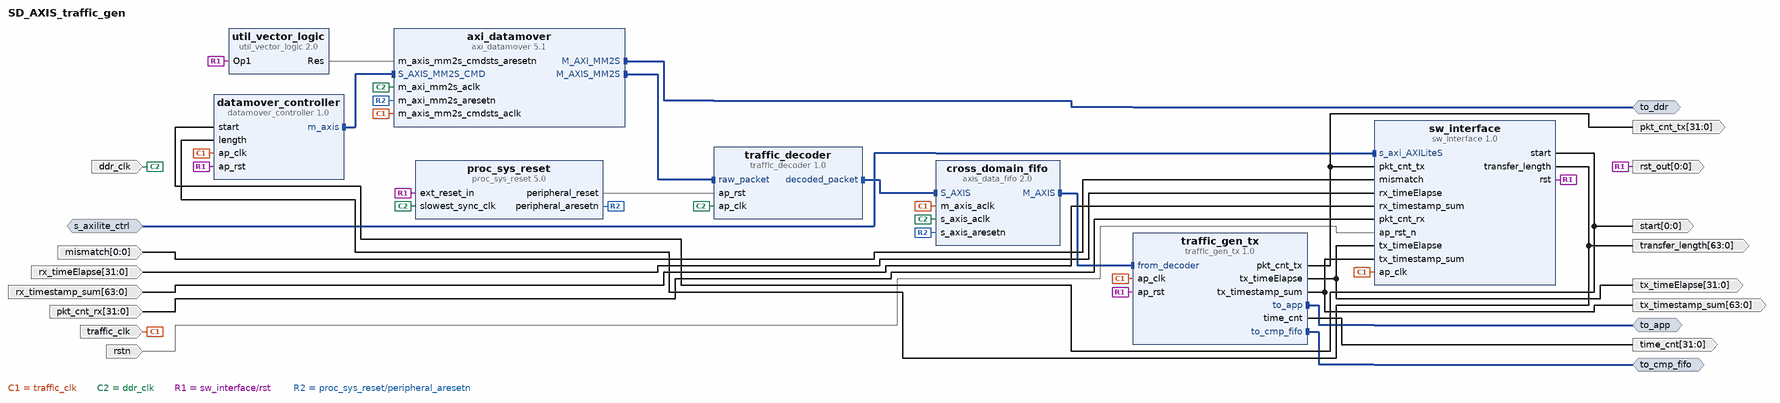
[diagram p0: block diagram of the top level]
# Vivado block design SD_AXIS_traffic_gen, xczu19eg-ffvc1760-2-i, Vivado 2019.1
create_bd_design SD_AXIS_traffic_gen

create_bd_intf_port -mode Slave -vlnv xilinx.com:interface:aximm_rtl:1.0 s_axilite_ctrl
set_property -dict [list \
  CONFIG.ADDR_WIDTH 12 \
  CONFIG.ARUSER_WIDTH 0 \
  CONFIG.AWUSER_WIDTH 0 \
  CONFIG.BUSER_WIDTH 0 \
  CONFIG.DATA_WIDTH 32 \
  CONFIG.HAS_BRESP 1 \
  CONFIG.HAS_BURST 0 \
  CONFIG.HAS_CACHE 0 \
  CONFIG.HAS_LOCK 0 \
  CONFIG.HAS_PROT 0 \
  CONFIG.HAS_QOS 0 \
  CONFIG.HAS_REGION 0 \
  CONFIG.HAS_RRESP 1 \
  CONFIG.HAS_WSTRB 1 \
  CONFIG.ID_WIDTH 0 \
  CONFIG.MAX_BURST_LENGTH 1 \
  CONFIG.NUM_READ_OUTSTANDING 1 \
  CONFIG.NUM_READ_THREADS 1 \
  CONFIG.NUM_WRITE_OUTSTANDING 1 \
  CONFIG.NUM_WRITE_THREADS 1 \
  CONFIG.PROTOCOL AXI4LITE \
  CONFIG.READ_WRITE_MODE READ_WRITE \
  CONFIG.RUSER_BITS_PER_BYTE 0 \
  CONFIG.RUSER_WIDTH 0 \
  CONFIG.SUPPORTS_NARROW_BURST 0 \
  CONFIG.WUSER_BITS_PER_BYTE 0 \
  CONFIG.WUSER_WIDTH 0 \
] [get_bd_intf_ports s_axilite_ctrl]
create_bd_intf_port -mode Master -vlnv xilinx.com:interface:axis_rtl:1.0 to_app
create_bd_intf_port -mode Master -vlnv xilinx.com:interface:aximm_rtl:1.0 to_ddr
set_property -dict [list \
  CONFIG.ADDR_WIDTH 64 \
  CONFIG.DATA_WIDTH 512 \
  CONFIG.HAS_BRESP 0 \
  CONFIG.HAS_BURST 0 \
  CONFIG.HAS_CACHE 0 \
  CONFIG.HAS_LOCK 0 \
  CONFIG.HAS_PROT 0 \
  CONFIG.HAS_QOS 0 \
  CONFIG.HAS_REGION 0 \
  CONFIG.HAS_WSTRB 0 \
  CONFIG.NUM_READ_OUTSTANDING 2 \
  CONFIG.NUM_WRITE_OUTSTANDING 2 \
  CONFIG.PROTOCOL AXI4 \
  CONFIG.READ_WRITE_MODE READ_ONLY \
] [get_bd_intf_ports to_ddr]
create_bd_intf_port -mode Master -vlnv xilinx.com:interface:axis_rtl:1.0 to_cmp_fifo
create_bd_port -dir I -from 0 -to 0 mismatch
create_bd_port -dir I -from 31 -to 0 rx_timeElapse
create_bd_port -dir I -from 63 -to 0 rx_timestamp_sum
create_bd_port -dir I -from 31 -to 0 pkt_cnt_rx
create_bd_port -dir I -type clk traffic_clk
create_bd_port -dir I -type rst rstn
create_bd_port -dir O -from 0 -to 0 start
create_bd_port -dir O -from 63 -to 0 transfer_length
create_bd_port -dir I -type clk ddr_clk
create_bd_port -dir O -from 31 -to 0 tx_timeElapse
create_bd_port -dir O -from 63 -to 0 tx_timestamp_sum
create_bd_port -dir O -from 31 -to 0 pkt_cnt_tx
create_bd_port -dir O -from 31 -to 0 time_cnt
create_bd_port -dir O -from 0 -to 0 -type rst rst_out

create_bd_cell -type ip -vlnv clarkshen.com:user:sw_interface:1.0 sw_interface
create_bd_cell -type ip -vlnv clarkshen.com:user:datamover_controller:1.0 datamover_controller
create_bd_cell -type ip -vlnv xilinx.com:ip:axi_datamover:5.1 axi_datamover
set_property -dict [list \
  CONFIG.c_addr_width 64 \
  CONFIG.c_dummy 1 \
  CONFIG.c_enable_s2mm 0 \
  CONFIG.c_m_axi_mm2s_data_width 512 \
  CONFIG.c_m_axi_mm2s_id_width 0 \
  CONFIG.c_m_axis_mm2s_tdata_width 512 \
  CONFIG.c_mm2s_btt_used 23 \
  CONFIG.c_mm2s_burst_size 64 \
] [get_bd_cells axi_datamover]
create_bd_cell -type ip -vlnv clarkshen.com:user:traffic_decoder:1.0 traffic_decoder
create_bd_cell -type ip -vlnv xilinx.com:ip:axis_data_fifo:2.0 cross_domain_fifo
set_property -dict {CONFIG.FIFO_DEPTH 64 CONFIG.IS_ACLK_ASYNC 1 CONFIG.SYNCHRONIZATION_STAGES 8} [get_bd_cells cross_domain_fifo]
create_bd_cell -type ip -vlnv clarkshen.com:user:traffic_gen_tx:1.0 traffic_gen_tx
create_bd_cell -type ip -vlnv xilinx.com:ip:util_vector_logic:2.0 util_vector_logic
set_property -dict {CONFIG.C_OPERATION not CONFIG.C_SIZE 1} [get_bd_cells util_vector_logic]
create_bd_cell -type ip -vlnv xilinx.com:ip:proc_sys_reset:5.0 proc_sys_reset
set_property -dict {CONFIG.C_EXT_RST_WIDTH 1} [get_bd_cells proc_sys_reset]

# ---- connections ----

connect_bd_intf_net -intf_net s_axi_AXILiteS_0_1 [get_bd_intf_ports s_axilite_ctrl] [get_bd_intf_pins sw_interface/s_axi_AXILiteS]
connect_bd_intf_net [get_bd_intf_ports to_app] [get_bd_intf_pins traffic_gen_tx/to_app]
connect_bd_intf_net [get_bd_intf_ports to_ddr] [get_bd_intf_pins axi_datamover/M_AXI_MM2S]
connect_bd_intf_net [get_bd_intf_ports to_cmp_fifo] [get_bd_intf_pins traffic_gen_tx/to_cmp_fifo]
connect_bd_intf_net [get_bd_intf_pins datamover_controller/m_axis] [get_bd_intf_pins axi_datamover/S_AXIS_MM2S_CMD]
connect_bd_intf_net [get_bd_intf_pins axi_datamover/M_AXIS_MM2S] [get_bd_intf_pins traffic_decoder/raw_packet]
connect_bd_intf_net [get_bd_intf_pins traffic_decoder/decoded_packet] [get_bd_intf_pins cross_domain_fifo/S_AXIS]
connect_bd_intf_net [get_bd_intf_pins cross_domain_fifo/M_AXIS] [get_bd_intf_pins traffic_gen_tx/from_decoder]
connect_bd_net -net mismatch_0_1 [get_bd_ports mismatch] [get_bd_pins sw_interface/mismatch]
connect_bd_net -net rx_timeElapse_0_1 [get_bd_ports rx_timeElapse] [get_bd_pins sw_interface/rx_timeElapse]
connect_bd_net -net rx_timestamp_sum_0_1 [get_bd_ports rx_timestamp_sum] [get_bd_pins sw_interface/rx_timestamp_sum]
connect_bd_net -net pkt_cnt_rx_0_1 [get_bd_ports pkt_cnt_rx] [get_bd_pins sw_interface/pkt_cnt_rx]
connect_bd_net -net ap_clk_0_1 [get_bd_ports traffic_clk] \
  [get_bd_pins sw_interface/ap_clk] [get_bd_pins datamover_controller/ap_clk] \
  [get_bd_pins axi_datamover/m_axis_mm2s_cmdsts_aclk] [get_bd_pins cross_domain_fifo/m_axis_aclk] \
  [get_bd_pins traffic_gen_tx/ap_clk]
connect_bd_net -net ap_rst_n_0_1 [get_bd_ports rstn] [get_bd_pins sw_interface/ap_rst_n]
connect_bd_net [get_bd_pins sw_interface/start] [get_bd_ports start] [get_bd_pins datamover_controller/start]
connect_bd_net [get_bd_pins sw_interface/transfer_length] [get_bd_ports transfer_length] [get_bd_pins datamover_controller/length]
connect_bd_net -net ap_clk_1_1 [get_bd_ports ddr_clk] \
  [get_bd_pins traffic_decoder/ap_clk] [get_bd_pins axi_datamover/m_axi_mm2s_aclk] \
  [get_bd_pins proc_sys_reset/slowest_sync_clk] [get_bd_pins cross_domain_fifo/s_axis_aclk]
connect_bd_net [get_bd_pins traffic_gen_tx/tx_timeElapse] [get_bd_ports tx_timeElapse] [get_bd_pins sw_interface/tx_timeElapse]
connect_bd_net [get_bd_pins traffic_gen_tx/tx_timestamp_sum] [get_bd_ports tx_timestamp_sum] [get_bd_pins sw_interface/tx_timestamp_sum]
connect_bd_net [get_bd_pins traffic_gen_tx/pkt_cnt_tx] [get_bd_ports pkt_cnt_tx] [get_bd_pins sw_interface/pkt_cnt_tx]
connect_bd_net [get_bd_pins traffic_gen_tx/time_cnt] [get_bd_ports time_cnt]
connect_bd_net [get_bd_pins sw_interface/rst] \
  [get_bd_ports rst_out] [get_bd_pins traffic_gen_tx/ap_rst] [get_bd_pins datamover_controller/ap_rst] \
  [get_bd_pins util_vector_logic/Op1] [get_bd_pins proc_sys_reset/ext_reset_in]
connect_bd_net [get_bd_pins proc_sys_reset/peripheral_aresetn] \
  [get_bd_pins axi_datamover/m_axi_mm2s_aresetn] [get_bd_pins cross_domain_fifo/s_axis_aresetn]
connect_bd_net [get_bd_pins util_vector_logic/Res] [get_bd_pins axi_datamover/m_axis_mm2s_cmdsts_aresetn]
connect_bd_net [get_bd_pins proc_sys_reset/peripheral_reset] [get_bd_pins traffic_decoder/ap_rst]

# ---- address map ----
assign_bd_address -offset 0x0000000000000000 -range 16G -target_address_space [get_bd_addr_spaces axi_datamover/Data_MM2S] [get_bd_addr_segs to_ddr/Reg]
assign_bd_address -offset 0x000 -range 4K -target_address_space [get_bd_addr_spaces s_axilite_ctrl] [get_bd_addr_segs sw_interface/s_axi_AXILiteS/reg0]

validate_bd_design
save_bd_design
